# Altium schematic sheet MotionBoard_V2.SchDoc
size A3; SheetNumber: 1; SheetTotal: 2
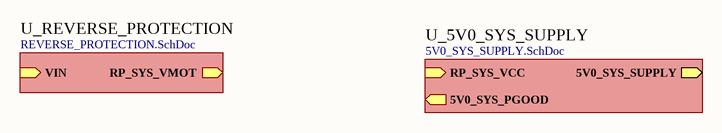
[diagram p0: MotionBoard_V2.SchDoc]

## Sub-sheets
U_5V0_SYS_SUPPLY = 5V0_SYS_SUPPLY.SchDoc: 5V0_SYS_SUPPLY (out), 5V0_SYS_PGOOD (out), RP_SYS_VCC (in)
U_REVERSE_PROTECTION = REVERSE_PROTECTION.SchDoc: VIN (in), RP_SYS_VMOT (out)